# Altium schematic sheet Button.SchDoc
size A
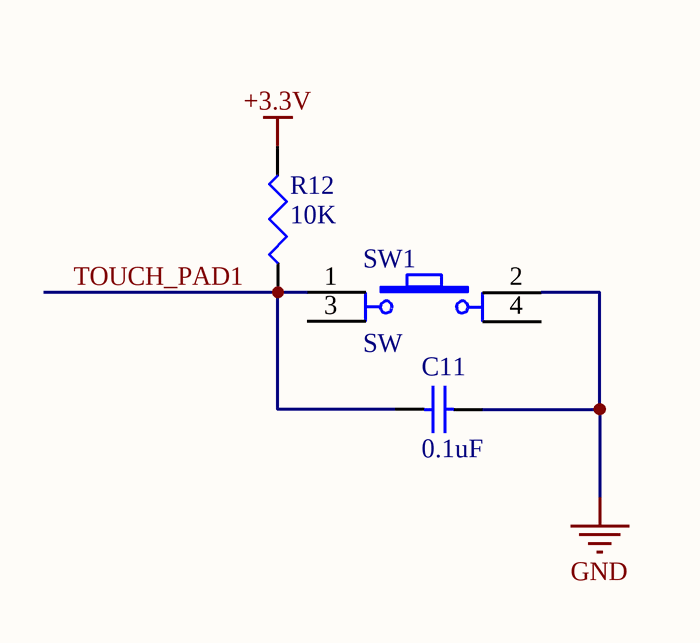
[diagram p0: Button.SchDoc]

## Parts
C11  0.1uF  [C0603]
R12  10K  [J1-0603]
SW1  SW  [SW4]

## Nets
+3.3V: R12.2
GND: C11.1 SW1.2
TOUCH_PAD1: C11.2 R12.1 SW1.1

Not connected (* = marked no-connect by the designer): SW1 3 4

## Library data of the parts
C11 = Cap Semi: Capacitor (Semiconductor SIM Model); Published: 8-Jun-2000; LatestRevisionDate: 29-May-2009; LatestRevisionNote: IPC-7351 Footprint Added.; PackageReference: C1206; Publisher: Altium Limited; PackageDescription: Chip Capacitor; Value: 0.1uF
R12 = Res3: Resistor; Value: 1K; Published: 8-Jun-2000; LatestRevisionDate: 29-May-2009; LatestRevisionNote: IPC-7351 Footprint Added.; PackageReference: J1-0603; Publisher: Altium Limited; PackageDescription: Chip Resistor
SW1 = SW4: Switch button 4 pin; Value: Button chip 4 pin